# Altium schematic sheet IO.SchDoc
size A4; SheetNumber: 5; SheetTotal: 5
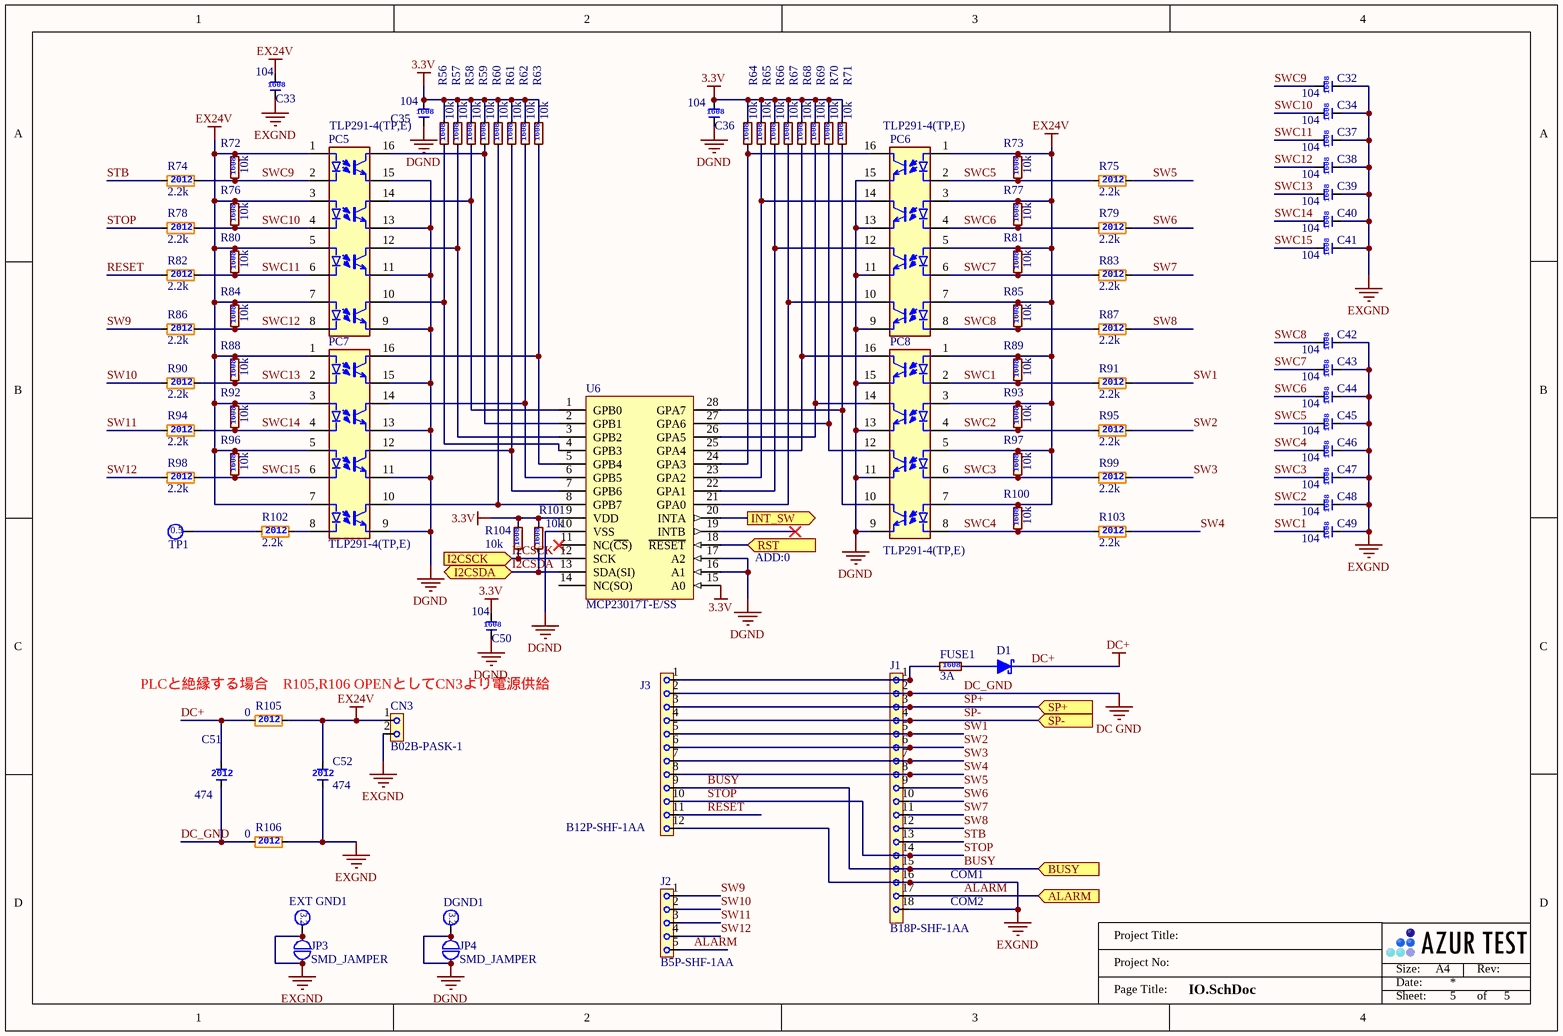
[diagram p0: IO.SchDoc]

## Parts
C32  Tag: 104  [C1608]  (hidden comment: CGA3E2X7R1H104K080AA)
C33  Tag: 104  [C1608]  (hidden comment: CGA3E2X7R1H104K080AA)
C34  Tag: 104  [C1608]  (hidden comment: CGA3E2X7R1H104K080AA)
C35  Tag: 104  [C1608]  (hidden comment: CGA3E2X7R1H104K080AA)
C36  Tag: 104  [C1608]  (hidden comment: CGA3E2X7R1H104K080AA)
C37  Tag: 104  [C1608]  (hidden comment: CGA3E2X7R1H104K080AA)
C38  Tag: 104  [C1608]  (hidden comment: CGA3E2X7R1H104K080AA)
C39  Tag: 104  [C1608]  (hidden comment: CGA3E2X7R1H104K080AA)
C40  Tag: 104  [C1608]  (hidden comment: CGA3E2X7R1H104K080AA)
C41  Tag: 104  [C1608]  (hidden comment: CGA3E2X7R1H104K080AA)
C42  Tag: 104  [C1608]  (hidden comment: CGA3E2X7R1H104K080AA)
C43  Tag: 104  [C1608]  (hidden comment: CGA3E2X7R1H104K080AA)
C44  Tag: 104  [C1608]  (hidden comment: CGA3E2X7R1H104K080AA)
C45  Tag: 104  [C1608]  (hidden comment: CGA3E2X7R1H104K080AA)
C46  Tag: 104  [C1608]  (hidden comment: CGA3E2X7R1H104K080AA)
C47  Tag: 104  [C1608]  (hidden comment: CGA3E2X7R1H104K080AA)
C48  Tag: 104  [C1608]  (hidden comment: CGA3E2X7R1H104K080AA)
C49  Tag: 104  [C1608]  (hidden comment: CGA3E2X7R1H104K080AA)
C50  Tag: 104  [C1608]  (hidden comment: CGA3E2X7R1H104K080AA)
C51  Tag: 474  [C2012]  (hidden comment: GRM21BR71H474MA88)
C52  Tag: 474  [C2012]  (hidden comment: GRM21BR71H474MA88)
CN3  B02B-PASK-1  [B02B-PASK-1]
D1  SIPS3150U  [DO-214AA]  (value not drawn)
DGND1  TP3.2mm  [TP3.2mm]  (value not drawn)  (no BOM)
EXT_GND1  TP3.2mm  [TP3.2mm]  (value not drawn)  (no BOM)
FUSE1  Tag: 3A  [R1608]  (hidden comment: ERB-RE3R00V)
J1  B18P-SHF-1AA  [B18P-SHF-1AA]
J2  B5P-SHF-1AA  [B5P-SHF-1AA]
J3  B12P-SHF-1AA  [B12P-SHF-1AA]
JP3  SMD_JAMPER  [SMD_JAMPER -Cut]  (no BOM)
JP4  SMD_JAMPER  [SMD_JAMPER -Cut]  (no BOM)
PC5  TLP291-4(TP,E)  [SO16]
PC6  TLP291-4(TP,E)  [SO16]
PC7  TLP291-4(TP,E)  [SO16]
PC8  TLP291-4(TP,E)  [SO16]
R56  Tag: 10k  [R1608]  (hidden comment: ERJ-PA3F1002V)
R57  Tag: 10k  [R1608]  (hidden comment: ERJ-PA3F1002V)
R58  Tag: 10k  [R1608]  (hidden comment: ERJ-PA3F1002V)
R59  Tag: 10k  [R1608]  (hidden comment: ERJ-PA3F1002V)
R60  Tag: 10k  [R1608]  (hidden comment: ERJ-PA3F1002V)
R61  Tag: 10k  [R1608]  (hidden comment: ERJ-PA3F1002V)
R62  Tag: 10k  [R1608]  (hidden comment: ERJ-PA3F1002V)
R63  Tag: 10k  [R1608]  (hidden comment: ERJ-PA3F1002V)
R64  Tag: 10k  [R1608]  (hidden comment: ERJ-PA3F1002V)
R65  Tag: 10k  [R1608]  (hidden comment: ERJ-PA3F1002V)
R66  Tag: 10k  [R1608]  (hidden comment: ERJ-PA3F1002V)
R67  Tag: 10k  [R1608]  (hidden comment: ERJ-PA3F1002V)
R68  Tag: 10k  [R1608]  (hidden comment: ERJ-PA3F1002V)
R69  Tag: 10k  [R1608]  (hidden comment: ERJ-PA3F1002V)
R70  Tag: 10k  [R1608]  (hidden comment: ERJ-PA3F1002V)
R71  Tag: 10k  [R1608]  (hidden comment: ERJ-PA3F1002V)
R72  Tag: 10k  [R1608]  (hidden comment: ERJ-PA3F1002V)
R73  Tag: 10k  [R1608]  (hidden comment: ERJ-PA3F1002V)
R74  Tag: 2.2k  [R2012]  (hidden comment: ERJ-P08J222V)
R75  Tag: 2.2k  [R2012]  (hidden comment: ERJ-P08J222V)
R76  Tag: 10k  [R1608]  (hidden comment: ERJ-PA3F1002V)
R77  Tag: 10k  [R1608]  (hidden comment: ERJ-PA3F1002V)
R78  Tag: 2.2k  [R2012]  (hidden comment: ERJ-P08J222V)
R79  Tag: 2.2k  [R2012]  (hidden comment: ERJ-P08J222V)
R80  Tag: 10k  [R1608]  (hidden comment: ERJ-PA3F1002V)
R81  Tag: 10k  [R1608]  (hidden comment: ERJ-PA3F1002V)
R82  Tag: 2.2k  [R2012]  (hidden comment: ERJ-P08J222V)
R83  Tag: 2.2k  [R2012]  (hidden comment: ERJ-P08J222V)
R84  Tag: 10k  [R1608]  (hidden comment: ERJ-PA3F1002V)
R85  Tag: 10k  [R1608]  (hidden comment: ERJ-PA3F1002V)
R86  Tag: 2.2k  [R2012]  (hidden comment: ERJ-P08J222V)
R87  Tag: 2.2k  [R2012]  (hidden comment: ERJ-P08J222V)
R88  Tag: 10k  [R1608]  (hidden comment: ERJ-PA3F1002V)
R89  Tag: 10k  [R1608]  (hidden comment: ERJ-PA3F1002V)
R90  Tag: 2.2k  [R2012]  (hidden comment: ERJ-P08J222V)
R91  Tag: 2.2k  [R2012]  (hidden comment: ERJ-P08J222V)
R92  Tag: 10k  [R1608]  (hidden comment: ERJ-PA3F1002V)
R93  Tag: 10k  [R1608]  (hidden comment: ERJ-PA3F1002V)
R94  Tag: 2.2k  [R2012]  (hidden comment: ERJ-P08J222V)
R95  Tag: 2.2k  [R2012]  (hidden comment: ERJ-P08J222V)
R96  Tag: 10k  [R1608]  (hidden comment: ERJ-PA3F1002V)
R97  Tag: 10k  [R1608]  (hidden comment: ERJ-PA3F1002V)
R98  Tag: 2.2k  [R2012]  (hidden comment: ERJ-P08J222V)
R99  Tag: 2.2k  [R2012]  (hidden comment: ERJ-P08J222V)
R100  Tag: 10k  [R1608]  (hidden comment: ERJ-PA3F1002V)
R101  Tag: 10k  [R1608]  (hidden comment: ERJ-PA3F1002V)
R102  Tag: 2.2k  [R2012]  (hidden comment: ERJ-P08J222V)
R103  Tag: 2.2k  [R2012]  (hidden comment: ERJ-P08J222V)
R104  Tag: 10k  [R1608]  (hidden comment: ERJ-PA3F1002V)
R105  Tag: 0  [R2012]  (hidden comment: ERJ-6GEY0R00V)
R106  Tag: 0  [R2012]  (hidden comment: ERJ-6GEY0R00V)
TP1  TP0.5mm  [TP0.5mm]  (value not drawn)  (no BOM)
U6  MCP23017T-E/SS  [SSOP28]

## Ports
ALARM (in), BUSY (in), I2CSCK (in), I2CSDA (bidir), INT_SW (out), RST (in), SP+ (in), SP- (in)

## Nets
3.3V: C35.2 C36.2 C50.2 R56.2 R57.2 R58.2 R59.2 R60.2 R61.2 R62.2 R63.2 R64.2 R65.2 R66.2 R67.2 R68.2 R69.2 R70.2 R71.2 R101.2 R104.2 U6.9(VDD) U6.15(A0)
DC+: C51.2 D1.K R105.1
DC_GND: C51.1 J1.2 J3.2 R106.1  [also labelled DC GND]
DGND: C35.1 C36.1 C50.1 DGND1.1 JP4.1 JP4.2 PC5.9(E) PC5.11(E) PC5.13(E) PC5.15(E) PC6.9(E) PC6.11(E) PC6.13(E) PC6.15(E) PC7.9(E) PC7.11(E) PC7.13(E) PC7.15(E) PC8.9(E) PC8.11(E) PC8.13(E) PC8.15(E) U6.10(VSS) U6.16(A1) U6.17(A2)
EX24V: C33.2 C52.2 CN3.1 PC5.1(A-LED) PC5.3(A-LED) PC5.5(A-LED) PC5.7(A-LED) PC6.1(A-LED) PC6.3(A-LED) PC6.5(A-LED) PC6.7(A-LED) PC7.1(A-LED) PC7.3(A-LED) PC7.5(A-LED) PC7.7(A-LED) PC8.1(A-LED) PC8.3(A-LED) PC8.5(A-LED) PC8.7(A-LED) R72.2 R73.2 R76.2 R77.2 R80.2 R81.2 R84.2 R85.2 R88.2 R89.2 R92.2 R93.2 R96.2 R97.2 R100.2 R105.2
EXGND: C32.1 C33.1 C34.1 C37.1 C38.1 C39.1 C40.1 C41.1 C42.1 C43.1 C44.1 C45.1 C46.1 C47.1 C48.1 C49.1 C52.1 CN3.2 EXT_GND1.1 J1.16 J1.18 J3.12 JP3.1 JP3.2 R106.2
ALARM: J1.17 J2.5 ; port ALARM
BUSY: J1.15 J3.9 ; port BUSY
I2CSCK: R104.1 U6.12(SCK) ; port I2CSCK
I2CSDA: R101.1 U6.13(SDA(SI)) ; port I2CSDA
INT_SW: U6.20(INTA) ; port INT_SW
RESET: J3.11 R82.1
RST: U6.18(~{RESET}) ; port RST
SP+: J1.3 J3.3 ; port SP+
SP-: J1.4 J3.4 ; port SP-
STB: J1.13 R74.1
STOP: J1.14 J3.10 R78.1
SW1: J1.5 J3.5 R91.2
SW2: J1.6 J3.6 R95.2
SW3: J1.7 J3.7 R99.2
SW4: J1.8 J3.8 R103.2
SW5: J1.9 R75.2
SW6: J1.10 R79.2
SW7: J1.11 R83.2
SW8: J1.12 R87.2
SW9: J2.1 R86.1
SW10: J2.2 R90.1
SW11: J2.3 R94.1
SW12: J2.4 R98.1
SWC1: C49.2 PC8.2(K-LED) R89.1 R91.1
SWC2: C48.2 PC8.4(K-LED) R93.1 R95.1
SWC3: C47.2 PC8.6(K-LED) R97.1 R99.1
SWC4: C46.2 PC8.8(K-LED) R100.1 R103.1
SWC5: C45.2 PC6.2(K-LED) R73.1 R75.1
SWC6: C44.2 PC6.4(K-LED) R77.1 R79.1
SWC7: C43.2 PC6.6(K-LED) R81.1 R83.1
SWC8: C42.2 PC6.8(K-LED) R85.1 R87.1
SWC9: C32.2 PC5.2(K-LED) R72.1 R74.2
SWC10: C34.2 PC5.4(K-LED) R76.1 R78.2
SWC11: C37.2 PC5.6(K-LED) R80.1 R82.2
SWC12: C38.2 PC5.8(K-LED) R84.1 R86.2
SWC13: C39.2 PC7.2(K-LED) R88.1 R90.2
SWC14: C40.2 PC7.4(K-LED) R92.1 R94.2
SWC15: C41.2 PC7.6(K-LED) R96.1 R98.2
NetD1_A: D1.A FUSE1.2
NetFUSE1_1: FUSE1.1 J1.1 J3.1
NetPC5_10: PC5.10(C) R56.1 U6.4(GPB3)
NetPC5_12: PC5.12(C) R57.1 U6.3(GPB2)
NetPC5_14: PC5.14(C) R58.1 U6.1(GPB0)
NetPC5_16: PC5.16(C) R59.1 U6.2(GPB1)
NetPC6_10: PC6.10(C) R67.1 U6.21(GPA0)
NetPC6_12: PC6.12(C) R66.1 U6.22(GPA1)
NetPC6_14: PC6.14(C) R65.1 U6.23(GPA2)
NetPC6_16: PC6.16(C) R64.1 U6.24(GPA3)
NetPC7_8: PC7.8(K-LED) R102.2
NetPC7_10: PC7.10(C) R60.1 U6.8(GPB7)
NetPC7_12: PC7.12(C) R61.1 U6.7(GPB6)
NetPC7_14: PC7.14(C) R62.1 U6.6(GPB5)
NetPC7_16: PC7.16(C) R63.1 U6.5(GPB4)
NetPC8_10: PC8.10(C) R71.1 U6.28(GPA7)
NetPC8_12: PC8.12(C) R70.1 U6.27(GPA6)
NetPC8_14: PC8.14(C) R69.1 U6.26(GPA5)
NetPC8_16: PC8.16(C) R68.1 U6.25(GPA4)
NetR102_1: R102.1 TP1.1

Not connected (* = marked no-connect by the designer): U6 11(NC(~{CS}))* 14(NC(SO)) 19(INTB)*

## Notes on the sheet
- ADD:0
- PLCと絶縁する場合　R105,R106 OPENとしてCN3より電源供給
- (near J1) COM2
- (near J1) COM1
- Project Title:
- Project No:
- Size:
- Date:
- A4
- Rev:
- Page Title:
- Sheet:
- of
- (in symbol C1608) 1608
- (in symbol C2012) 2012
- (in symbol MF2012) 2012
- (in symbol TF1608) 1608
- (in symbol TP0.5mm) 0.5
- (in symbol TP3.2mm) 3.2

## Library data of the parts
C32-C50 = C1608: セラコン1608サイズ; Vendor: TDK; Voltage: 50V
C51 C52 = C2012: セラコン2012サイズ; Vendor: Murata; Voltage: 50V
CN3 = B02B-PASK-1: 雄,ストレート,1列2ピン; Vendor: JST
D1 = Diode SMB 5.4x4.3: Schottky Rectifier; Vendor: STmicro; Voltage: 150V; Current: 3A
DGND1 EXT_GND1 = TP3.2mm: Test-Point 3.2mm
FUSE1 = TF1608: 3A 1608サイズ; Vendor: Panasonic
J1 = B18P-SHF-1AA: 雄,ストレート,1列12ピン PCB; Vendor: JST
J2 = B5P-SHF-1AA: 雄,ストレート,1列3ピン; Vendor: JST
J3 = B12P-SHF-1AA: 雄,ストレート,1列12ピン PCB; Vendor: JST
PC5-PC8 = TLP621: 4 Channel 16-SO; Vendor: Toshiba
R56-R73 R76 R77 R80 R81 R84 R85 R88 R89 R92 R93 R96 R97 R100 R101 R104 = TF1608: 厚膜チップ抵抗1608サイズ; Vendor: Panasonic
R74 R75 R78 R79 R82 R83 R86 R87 R90 R91 R94 R95 R98 R99 R102 R103 R105 R106 = MF2012: 薄膜チップ抵抗2012サイズ; Vendor: Panasonic
TP1 = TP0.5mm: Test-Point 0.5mm
U6 = MCP23_17T-E/SO: I/O Expander 16 SPI 10MHz 28-SOIC; Vendor: Microchip Technology